# Altium schematic sheet STM8_Project_ver_1.SchDoc: Microcontroller Project STM8
size A4; Author: Milosz Werner 253141; DrawnBy: Milosz Werner 253141; Organization: Wroclaw University of Science and Technology; Revision: ver. 1; SheetNumber: 1; SheetTotal: 1
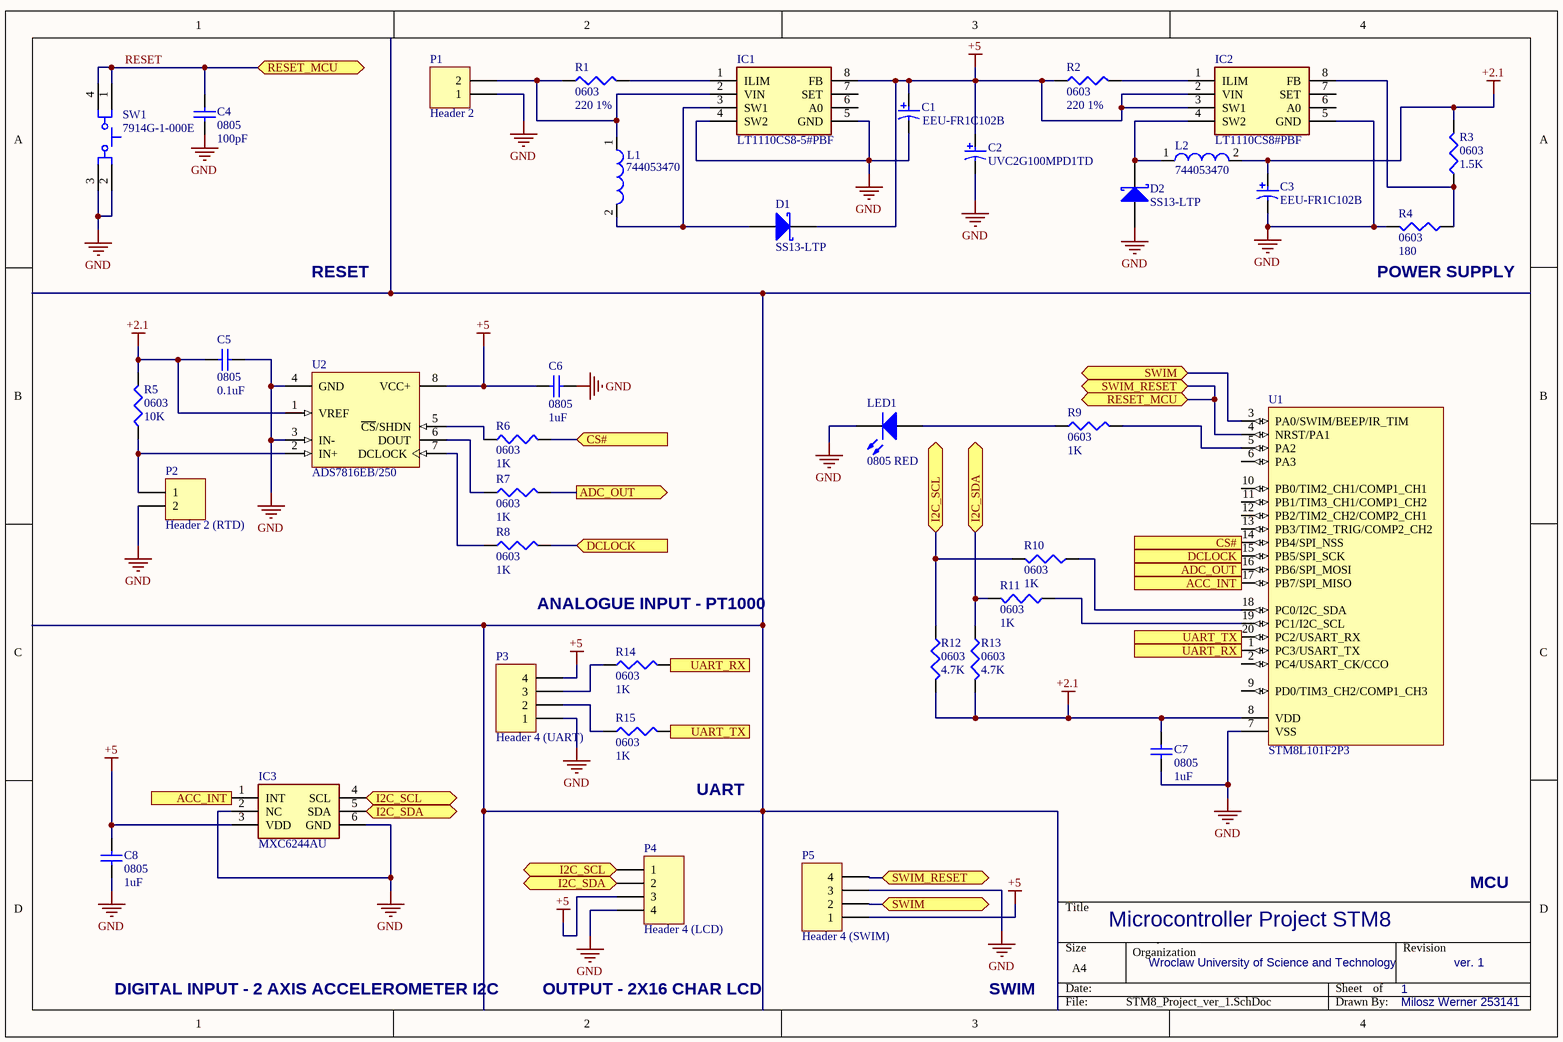
[diagram p0: STM8_Project_ver_1.SchDoc]

## Parts
C1  EEU-FR1C102B  [PNSC-EEUFM1H221-2]
C2  UVC2G100MPD1TD  [NIC-UVC2G100MPD1TD-2_V]
C3  EEU-FR1C102B  [PNSC-EEUFM1H221-2]
C4  0805  value 100pF  [C0805]
C5  0805  value 0.1uF  [C0805]
C6  0805  value 1uF  [C0805]
C7  0805  value 1uF  [C0805]
C8  0805  value 1uF  [C0805]
D1  SS13-LTP  [SMB]
D2  SS13-LTP  [SMB]
IC1  LT1110CS8-5#PBF  [SOIC127P599X175-8N]
IC2  LT1110CS8#PBF  [SOIC127P599X175-8N]
IC3  MXC6244AU  [MXC6244AU]
L1  744053470  [WE-TPC-5828-LH]
L2  744053470  [WE-TPC-5828-LH]
LED1  0805 RED  [0805_A]
P1  Header 2  [HDR1X2]
P2  Header 2 (RTD)  [HDR1X2]
P3  Header 4 (UART)  [HDR1X4]
P4  Header 4 (LCD)  [HDR1X4]
P5  Header 4 (SWIM)  [HDR1X4]
R1  0603  value 220 1%  [J1-0603]
R2  0603  value 220 1%  [J1-0603]
R3  0603  value 1.5K  [J1-0603]
R4  0603  value 180  [J1-0603]
R5  0603  value 10K  [J1-0603]
R6  0603  value 1K  [J1-0603]
R7  0603  value 1K  [J1-0603]
R8  0603  value 1K  [J1-0603]
R9  0603  value 1K  [J1-0603]
R10  0603  value 1K  [J1-0603]
R11  0603  value 1K  [J1-0603]
R12  0603  value 4.7K  [J1-0603]
R13  0603  value 4.7K  [J1-0603]
R14  0603  value 1K  [J1-0603]
R15  0603  value 1K  [J1-0603]
SW1  7914G-1-000E  [BOUR-7914G-1-000E_V]
U1  STM8L101F2P3  [TSSOP20_N]
U2  ADS7816EB/250  [TI-DGK8_N]

## Ports
ACC_INT (in), ACC_INT (out), ADC_OUT, ADC_OUT (out), CS# (in), CS# (out), DCLOCK (in), DCLOCK (out), I2C_SCL (bidir), I2C_SDA (bidir), RESET_MCU (bidir), SWIM (bidir), SWIM_RESET (bidir), UART_RX (in), UART_RX (out), UART_TX (in), UART_TX (out)

## Nets
+2.1: C3.1 C5.1 C7.1 L2.2 R3.2 R5.2 R12.2 R13.2 U1.8(VDD) U2.1(VREF)
+5: C1.1 C2.1 C6.2 C8.1 D1.2(K) IC1.8(FB) IC2.2(VIN) IC2.3(SW1) IC3.3(VDD) P3.4 P4.3 P5.1 R2.1 U2.8(VCC+)
GND: C1.2 C2.2 C3.2 C4.2 C5.2 C6.1 C7.2 C8.2 D2.1(A) IC1.4(SW2) IC1.5(GND) IC2.5(GND) IC3.2(NC) IC3.6(GND) LED1.1(K) P1.1 P2.2 P3.1 P4.4 P5.3 R4.2 SW1.2(+) SW1.3(+) U1.7(VSS) U2.3(IN-) U2.4(GND)
ACC_INT: IC3.1(INT) U1.17(PB7/SPI_MISO) ; port ACC_INT
ADC_OUT: R7.2 U1.16(PB6/SPI_MOSI) ; port ADC_OUT
CS#: R6.2 U1.14(PB4/SPI_NSS) ; port CS#
DCLOCK: R8.2 U1.15(PB5/SPI_SCK) ; port DCLOCK
I2C_SCL: IC3.4(SCL) P4.1 R10.2 R12.1 ; port I2C_SCL
I2C_SDA: IC3.5(SDA) P4.2 R11.2 R13.1 ; port I2C_SDA
RESET: C4.1 P5.4 SW1.1(-) SW1.4(-) U1.4(NRST/PA1) ; port RESET_MCU, port SWIM_RESET
SWIM: P5.2 U1.3(PA0/SWIM/BEEP/IR_TIM) ; port SWIM
UART_RX: R14.2 U1.1(PC3/USART_TX) ; port UART_RX
UART_TX: R15.2 U1.20(PC2/USART_RX) ; port UART_TX
NetD1_1: D1.1(A) IC1.3(SW1) L1.2
NetD2_2: D2.2(K) IC2.4(SW2) L2.1
NetIC1_1: IC1.1(ILIM) R1.2
NetIC1_2: IC1.2(VIN) L1.1 P1.2 R1.1
NetIC2_1: IC2.1(ILIM) R2.2
NetIC2_8: IC2.8(FB) R3.1 R4.1
NetLED1_2: LED1.2(A) R9.1
NetP2_1: P2.1 R5.1 U2.2(IN+)
NetP3_2: P3.2 R15.1
NetP3_3: P3.3 R14.1
NetR6_1: R6.1 U2.5(~{CS}/SHDN)
NetR7_1: R7.1 U2.6(DOUT)
NetR8_1: R8.1 U2.7(DCLOCK)
NetR9_2: R9.2 U1.5(PA2)
NetR10_1: R10.1 U1.18(PC0/I2C_SDA)
NetR11_1: R11.1 U1.19(PC1/I2C_SCL)

Not connected (* = marked no-connect by the designer): IC1 6(A0) 7(SET); IC2 6(A0) 7(SET); U1 2(PC4/USART_CK/CCO) 6(PA3) 9(PD0/TIM3_CH2/COMP1_CH3) 10(PB0/TIM2_CH1/COMP1_CH1) 11(PB1/TIM3_CH1/COMP1_CH2) 12(PB2/TIM2_CH2/COMP2_CH1) 13(PB3/TIM2_TRIG/COMP2_CH2)

## Notes on the sheet
- RESET
- (near R4) POWER SUPPLY
- ANALOGUE INPUT - PT1000
- UART
- MCU
- DIGITAL INPUT - 2 AXIS ACCELEROMETER I2C
- OUTPUT - 2X16 CHAR LCD
- SWIM
- Organization

## Library data of the parts
C1 C3 = CMP-2000-05313-1: Aluminum Electrolytic Capacitor, 1000 uF, +/- 20%, 16 V, -40 to 105 degC, 2-Pin THD, RoHS, Tape and Reel; Manufacturer: Panasonic; Capacitance: 1000µF; Ripple Current: 1790mA; Rated Voltage: 16V; Impedance: 0.028O; Type: Radial; Lifetime@Temperature: 8000Hrs@105degC; Operating Temp-Max: 105degC; Operating Temp Range: -40to+105degC; Manufacturer URL: http://www.panasonic.com/; Datasheet URL: http://www.produktinfo.conrad.com/datenblaetter/425000-449999/446746-da-01-en-ALU_KONDENSATOR_FR_R_1000_UF_16V.pdf; Case Size/Dimension: Ø10x16mm; Datasheet Version: Nov-11; Series: FR
C2 = CMP-0743-00001-1: Aluminum Electrolytic Capacitor, High Voltage, Ultra-Miniature-Sized for adapters, Polar, 400 V, 10uF, +/-20% Tolerance, -40 to 105 degC, 10 x 12.5 mm D X L, RoHS, Bulk; Manufacturer: Nichicon; Rated Ripple Current (at 120Hz): 100 mA; Rated Voltage: 400 V; Leakage Current (Short Term): 260 mA; Rated Ripple Current (at 100kHz): 150 mA; Packing: Bulk; ComponentLink2Description: Datasheet; Capacitance Tolerance: +/- 20%; Category Temperature Range: -40 to 105 degC; Series: VC; ComponentLink1URL: http://www.nichicon.co.jp/; Rated Capacitance Range: 10 uF; PackageVersion: Sep-13; PackageDescription: 2-Pin Radial Lead 10 x 12.5 mm, Lead-wire Diameter 0.6 mm, Pin Spacing 5 mm; Mounting Technology: Through Hole; RoHS: TRUE; ComponentLink1Description: Manufacturer URL; Diameter: 10 mm; PartNumber: UVC2G100MPD1TD; Length: 12.5 mm; ComponentLink2URL: http://nichicon-us.com/english/products/pdfs/e-vc.pdf; ComponentLink3URL: http://nichicon-us.com/english/products/pdfs/e-vc.pdf; DatasheetVersion: Sep-13; PackageReference: UVC2G100MPD1TD-2; ComponentLink3Description: Package Specification
C4-C8 = Cap: Capacitor; Published: 8-Jun-2000; LatestRevisionDate: 17-Jul-2002; LatestRevisionNote: Re-released for DXP Platform.; PackageReference: RAD-0.3; Publisher: Altium Limited; PackageDescription: Radial Cap, Thru-Hole; 2 Leads; 0.3 in Pin Spacing
D1 D2 = D Schottky: Schottky Diode; Published: 8-Jun-2000; LatestRevisionDate: 17-Jul-2002; LatestRevisionNote: Re-released for DXP Platform.; PackageReference: SMB; Publisher: Altium Limited; PackageDescription: DO-214-AA/SMB; 2 C-Bend Leads; Body 5.3 x 3.6 mm, inc. leads (LxW); Code_JEDEC: DO-214-AA
IC1 = LT1110CS8-5#PBF: Switching Voltage Regulators Micropower DC-DC Converter Fixed 5V; Manufacturer_Name: Linear Technology; Datasheet Link: https://www.analog.com/media/en/technical-documentation/data-sheets/lt1110.pdf; Height: 1.752mm; Manufacturer_Part_Number: LT1110CS8-5#PBF; Supplier 1: Mouser; Supplier Part Number 1: 584-LT1110CS8-5#PBF
IC2 = LT1110CS8#PBF: Switching Voltage Regulators Micropower DC-DC Converter Adjustable and Fixed 5V, 12V; Manufacturer_Name: Linear Technology; Datasheet Link: https://www.analog.com/media/en/technical-documentation/data-sheets/lt1110.pdf; Height: 1.752mm; Manufacturer_Part_Number: LT1110CS8#PBF; Mouser Part Number: 584-LT1110CS8#PBF; Mouser Price/Stock: https://www.mouser.com/Search/Refine.aspx?Keyword=584-LT1110CS8%23PBF; Supplier 1: Mouser; Supplier Part Number 1: 584-LT1110CS8#PBF
IC3 = MXC6244AU: Accelerometers +/- 8g Complete 2 Axis Accelerometer System with Programmable Internal anti-vibration Filter; Manufacturer_Name: MEMSIC; Datasheet Link: https://componentsearchengine.com/Datasheets/1/MXC6244AU.pdf; Height: 1.3mm; Manufacturer_Part_Number: MXC6244AU; Mouser Part Number: 438-MXC6244AU; Mouser Price/Stock: https://www.mouser.co.uk/ProductDetail/MEMSIC/MXC6244AU?qs=uBbGm2YIKJILg44aLNvpFw%3D%3D; Supplier 1: Mouser; Supplier Part Number 1: 438-MXC6244AU
L1 L2 = CMP-0227-00413-1: SMD Shielded Tiny Power Inductor WE-TPC, L = 47.0 µH; Inductance: 47.0 ÂµH; PackageVersion: 2010; ComponentLink2Description: Datasheet; ComponentLink2URL: http://www.we-online.de/katalog/media/pdf/744053470.pdf; ComponentLink1Description: Manufacturer Link; PackageDescription: SMD Inductor, 2-Leads, Body 5.8 x 5.8 mm; DatasheetVersion: ver 6, Aug-2010; ComponentLink1URL: http://www.we-online.com; PackageReference: WE-TPC-5828-LH
LED1 = CMP-1426-00010-1: SMD mono-color Chip LED, WL-SMCW, Super Red; Manufacturer: Wuerth Elektronik; PartNumber: 150080SS75000; PackageReference: 0805_A; ComponentLink2URL: http://katalog.we-online.com/led/datasheet/150080SS75000.pdf; ComponentLink1URL: http://www.we-online.com; Color: Super Red; ComponentLink2Description: Datasheet; ComponentLink1Description: Manufacturer URL
P1 P2 = Header 2: Header, 2-Pin; LatestRevisionDate: 17-Jul-2002; LatestRevisionNote: Re-released for DXP Platform.; Publisher: Altium Limited
P3-P5 = Header 4: Header, 4-Pin; LatestRevisionDate: 17-Jul-2002; LatestRevisionNote: Re-released for DXP Platform.; Publisher: Altium Limited
R1-R15 = Res3: Resistor; Published: 8-Jun-2000; LatestRevisionDate: 29-May-2009; LatestRevisionNote: IPC-7351 Footprint Added.; PackageReference: J1-0603; Publisher: Altium Limited; PackageDescription: Chip Resistor
SW1 = CMP-2000-05692-1: SPST Gull Wing Sealed Key Switch, 100 mA, 16 V, -55 to 125 degC, 4-Pin SMD, RoHS, Tape and Reel; Manufacturer: Bourns; COO: TW; Actuator Length: 1.65mm; Maximum Contact Resistance: 100mOhm; Ground Terminal: No; Mechanical Life: 100000Cycles; Contact Rating @ Voltage: 0.1A; Illumination Type: N/R; Body Orientation: Straight; Dielectric Strength: 250VAC; Maximum DC Voltage Rating: 16V; Base Material: Thermoplastic; Operating Force: 2.94N; Actuator Style: RoundButton; Switch Configuration: N.O.; Mounting: SurfaceMount,GullWing; Electrical Life: N/A; Seal Description: N/A; Datasheet Version: 08/2016; ECCN: EAR99; Product Weight: N/A; Seal Location: N/A; Actuator Color: N/A; Dimension: 5x6.2x4.19mm; Manufacturer URL: http://www.bourns.com/; Packaging: EmbossedTapeandReel; RoHS: Yes; Part No: 7914G-1-000E; Pole Throw Configuration: SPST; Supplier: Bourns; Type: KeySwitch; Mounting Technology: SurfaceMount; Datasheet URL: http://www.bourns.com/docs/Product-Datasheets/7914.pdf; Package Reference: 7914G-1-000E; Contact Material: Gold; Family: 7914; Housing Material: N/A; Minimum Insulation Resistance: 100MOhm; HTS: 8536509065; Contact Plating: N/A; Operating Temperature: -55to125C; Package Description: 4-Pin Surface Mount Device, Body 5 x 5 mm, Height 4.49 mm; Maximum AC Voltage Rating: 16V
U1 = CMP-0235-00079-1: STM8L ARM-based EnergyLite 8-bit MCU, 4 kB Flash, 1.5 kB Internal RAM, -40 to +85°C Temperature, 20-pin TSSOP, Tube; ComponentLink1Description: STM8L101 Datasheet; PackageDescription: 20-Pin Thin Shrink Small Package Outline 0.65 mm Pitch; ComponentLink2URL: http://www.st.com/internet/mcu/subclass/1381.jsp; PackageReference: TSSOP20; ComponentLink3URL: http://www.st.com/internet/com/home/home.jsp; ComponentLink3Description: st.com Home; ComponentLink2Description: STM8L Family Web Page; ComponentLink1URL: http://www.st.com/internet/com/TECHNICAL_RESOURCES/TECHNICAL_LITERATURE/DATASHEET/CD00220591.pdf; PackageVersion: 2010
U2 = CMP-0003-00360-2: 12-Bit High Speed Micro Power Sampling ADC, -40 to 85 degC, 8-pin SOP (DGK8), Green (RoHS & no Sb/Br); Manufacturer: Texas Instruments; Digital Supply(Min)(V): 4.75; INL(Max)(+/-LSB): 2; SFDR(dB): 86; Architecture: SAR; Analog Voltage AV/DD(Max)(V): 5.25; SINAD(dB): 72; # Input Channels: 1; Interface: Serial SPI; SubFamily: Precision ADC (<=10MSPS); Analog Voltage AV/DD(Min)(V): 4.5; Sample Rate (max)(SPS): 200k; Resolution(Bits): 12; ComponentLink1Description: Manufacturer URL; DatasheetVersion: SBAS061; ComponentLink3URL: http://www.ti.com/litv/pdf/mpds028d; Eco-Plan: Green (RoHS & no Sb/Br); ComponentLink3Description: Package Specification; ComponentLink2Description: Datasheet; PackageDescription: 8-Pin Thin Small Outline, Body 3 x 3 mm, Pitch 0.65 mm; Code_JEDEC: MO-187; PackageVersion: 4073329/E, 05/2006; Digital Supply(Max)(V): 5.25; ComponentLink1URL: http://www.ti.com/; PartNumber: ADS7816EB/250; Mounting Technology: Surface Mount; ComponentLink2URL: http://www.ti.com/general/docs/lit/getliterature.tsp?genericPartNumber=ADS7816&fileType=pdf; PackageReference: DGK8